# EAGLE design PaxInstrument-T400 (EAGLE 7.5.0)
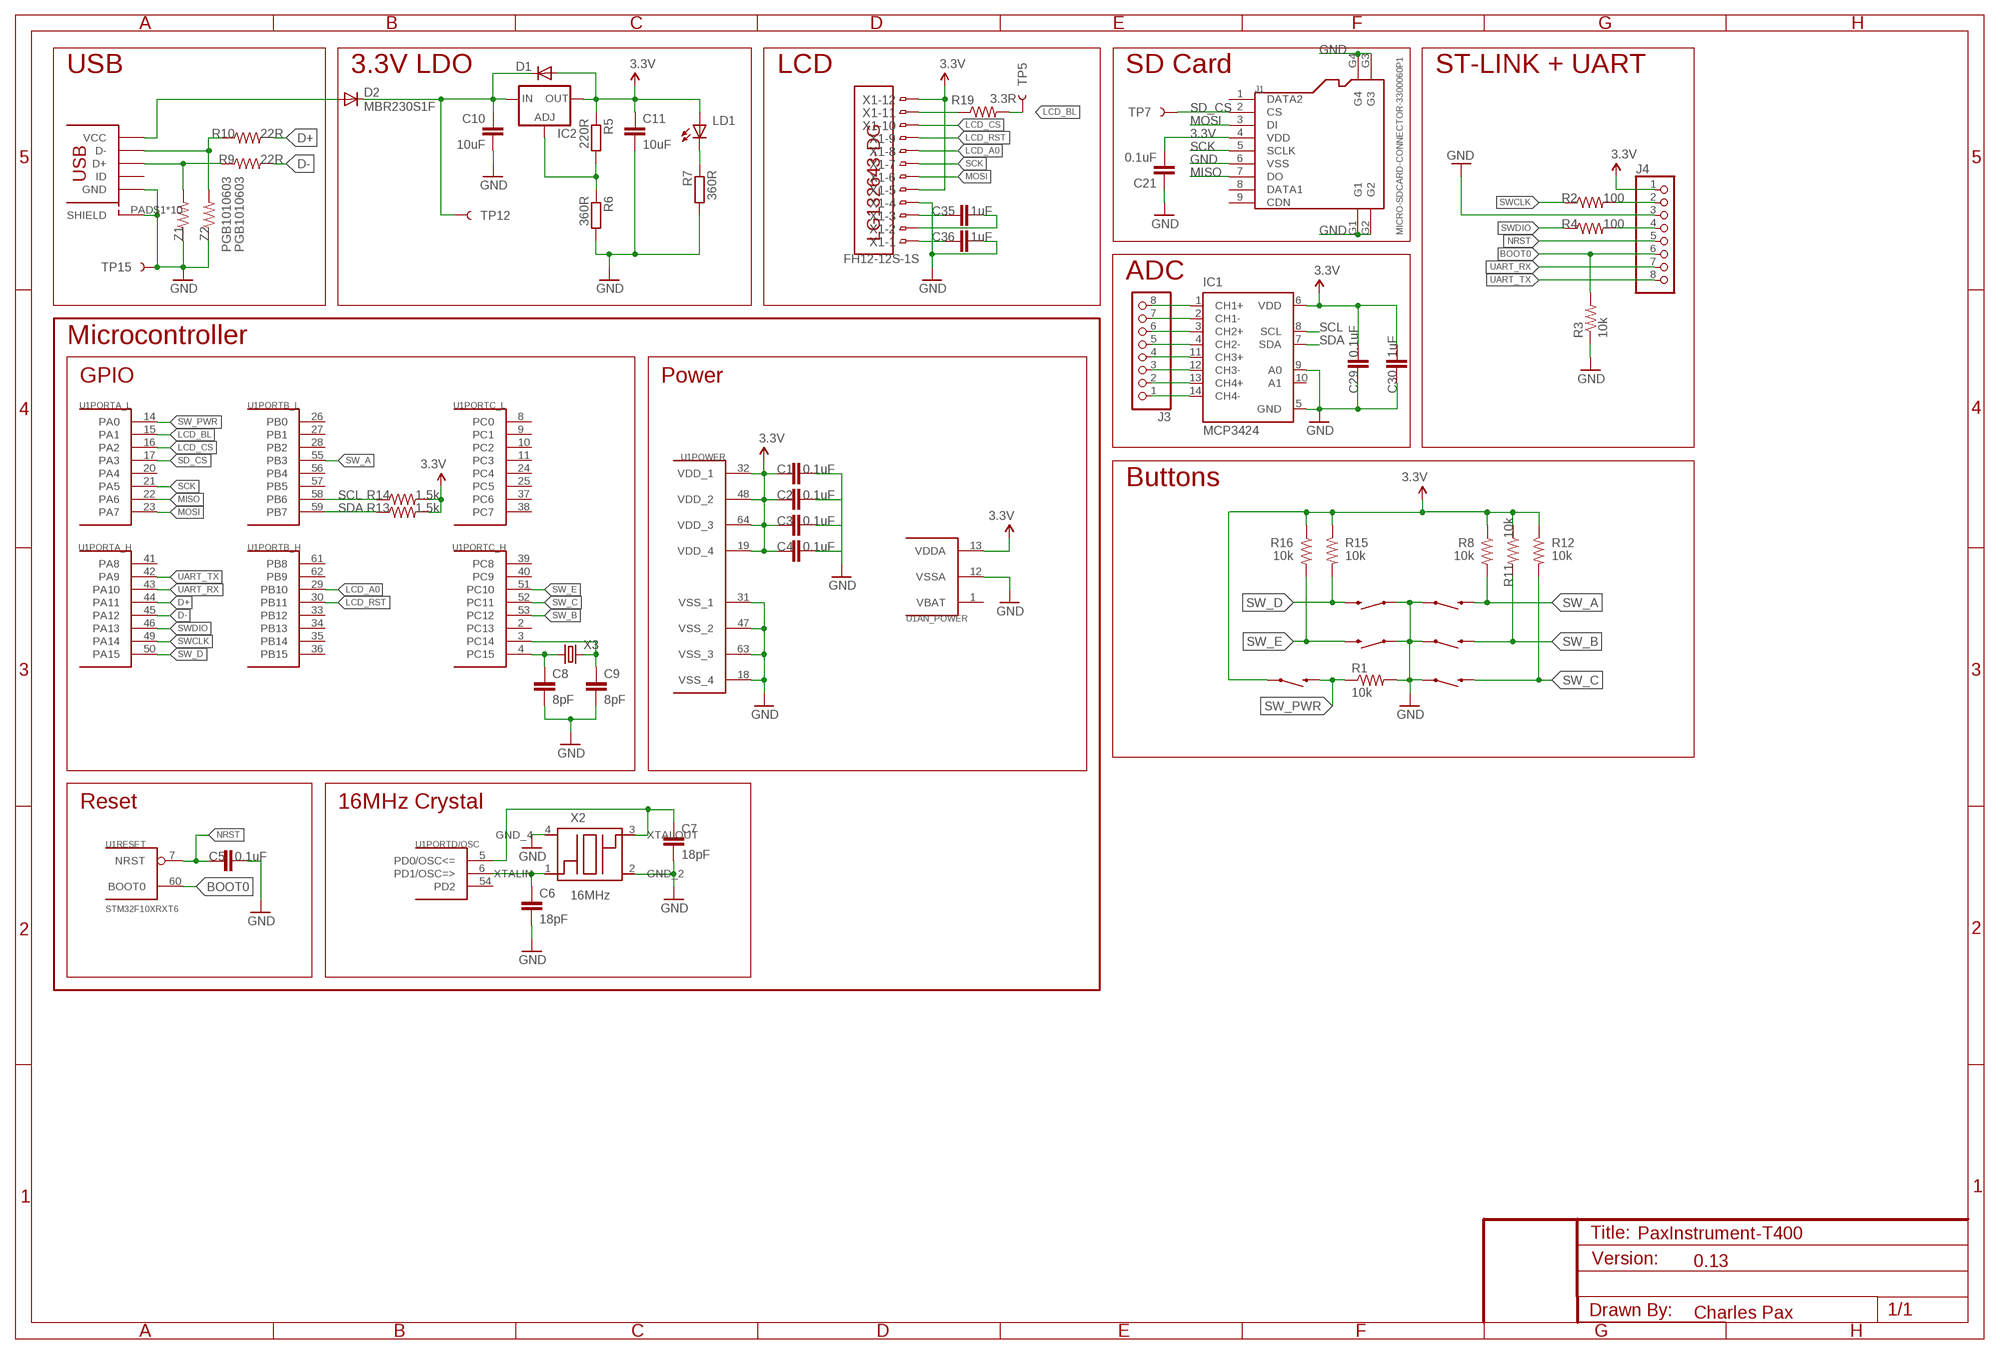
[diagram p0: schematic, sheet 1]

## Parts
C1  0.1uF  SPARKFUN-CAPACITORS_CAP0603-CAP  [SPARKFUN-CAPACITORS_0603-CAP]
C2  0.1uF  SPARKFUN-CAPACITORS_CAP0603-CAP  [SPARKFUN-CAPACITORS_0603-CAP]
C3  0.1uF  SPARKFUN-CAPACITORS_CAP0603-CAP  [SPARKFUN-CAPACITORS_0603-CAP]
C4  0.1uF  SPARKFUN-CAPACITORS_CAP0603-CAP  [SPARKFUN-CAPACITORS_0603-CAP]
C5  0.1uF  SPARKFUN-CAPACITORS_CAP0603-CAP  [SPARKFUN-CAPACITORS_0603-CAP]
C6  18pF  SPARKFUN-CAPACITORS_CAP0603-CAP  [SPARKFUN-CAPACITORS_0603-CAP]
C7  18pF  SPARKFUN-CAPACITORS_CAP0603-CAP  [SPARKFUN-CAPACITORS_0603-CAP]
C8  8pF  SPARKFUN-CAPACITORS_CAP0603-CAP  [SPARKFUN-CAPACITORS_0603-CAP]
C9  8pF  SPARKFUN-CAPACITORS_CAP0603-CAP  [SPARKFUN-CAPACITORS_0603-CAP]
C10  10uF  C0603  [0603]
C11  10uF  C0603  [0603]
C21  0.1uF  SPARKFUN-CAPACITORS_CAP0603-CAP  [SPARKFUN-CAPACITORS_0603-CAP]
C29  0.1uF  SPARKFUN-CAPACITORS_CAP0603-CAP  [SPARKFUN-CAPACITORS_0603-CAP]
C30  1uF  SPARKFUN-CAPACITORS_CAP0603-CAP  [SPARKFUN-CAPACITORS_0603-CAP]
C35  1uF  SPARKFUN-CAPACITORS_CAP0603-CAP  [SPARKFUN-CAPACITORS_0603-CAP]
C36  1uF  SPARKFUN-CAPACITORS_CAP0603-CAP  [SPARKFUN-CAPACITORS_0603-CAP]
D1  1N4148W  CGRM4001-G  [SOD-123_MINI-SMA]
D2  MBR230S1F  SPARKFUN-DISCRETESEMI_DIODESOD123SOD123  [SOD123]
IC1  MCP3424  [SO14]
IC2  LM317AEMP  LM317MSTT3  [SOT223]
J1  MICRO-SDCARD-CONNECTOR-3300060P1  [9P-SMD-W-RING]
J2  USB_MICROSMT+THRUHULE  [USB_MICRO_THRUHOLE]
J3  PINHD-1X8  [1X08]
J4  PINHD-1X8  [1X08]
LD1  LEDCHIPLED_0805  [CHIPLED_0805]
R1  10k  SPARKFUN-RESISTORS_RESISTOR0603-RES  [SPARKFUN-RESISTORS_0603-RES]
R2  100  SPARKFUN-RESISTORS_RESISTOR0603-RES  [SPARKFUN-RESISTORS_0603-RES]
R3  10k  SPARKFUN-RESISTORS_RESISTOR0603-RES  [SPARKFUN-RESISTORS_0603-RES]
R4  100  SPARKFUN-RESISTORS_RESISTOR0603-RES  [SPARKFUN-RESISTORS_0603-RES]
R5  220R  R0603  [0603]
R6  360R  R0603  [0603]
R7  360R  R0603  [0603]
R8  10k  SPARKFUN-RESISTORS_RESISTOR0603-RES  [SPARKFUN-RESISTORS_0603-RES]
R9  22R  SPARKFUN-RESISTORS_RESISTOR0603-RES  [SPARKFUN-RESISTORS_0603-RES]
R10  22R  SPARKFUN-RESISTORS_RESISTOR0603-RES  [SPARKFUN-RESISTORS_0603-RES]
R11  10k  SPARKFUN-RESISTORS_RESISTOR0603-RES  [SPARKFUN-RESISTORS_0603-RES]
R12  10k  SPARKFUN-RESISTORS_RESISTOR0603-RES  [SPARKFUN-RESISTORS_0603-RES]
R13  1.5k  SPARKFUN-RESISTORS_RESISTOR0603-RES  [SPARKFUN-RESISTORS_0603-RES]
R14  1.5k  SPARKFUN-RESISTORS_RESISTOR0603-RES  [SPARKFUN-RESISTORS_0603-RES]
R15  10k  SPARKFUN-RESISTORS_RESISTOR0603-RES  [SPARKFUN-RESISTORS_0603-RES]
R16  10k  SPARKFUN-RESISTORS_RESISTOR0603-RES  [SPARKFUN-RESISTORS_0603-RES]
R19  3.3R  SPARKFUN-RESISTORS_RESISTOR0603-RES  [SPARKFUN-RESISTORS_0603-RES]
S1  SWITCH-MOMENTARY-2SMD  [TACTILE_SWITCH_SMD]
S2  SWITCH-MOMENTARY-2SMD  [TACTILE_SWITCH_SMD]
S3  SWITCH-MOMENTARY-2SMD  [TACTILE_SWITCH_SMD]
S4  SWITCH-MOMENTARY-2SMD  [TACTILE_SWITCH_SMD]
S5  SWITCH-MOMENTARY-2SMD  [TACTILE_SWITCH_SMD]
S6  SWITCH-MOMENTARY-2SMD  [TACTILE_SWITCH_SMD]
TP5  LCD_BL  TEST-POINTTP_15TH_THRU  [TP_15TH]
TP7  SD_CS  TEST-POINTTP_15TH_THRU  [TP_15TH]
TP12  VBUS  TEST-POINTTP_15TH_THRU  [TP_15TH]
TP15  GND  TEST-POINTTP_15TH_THRU  [TP_15TH]
U1  STM32F10XRXT6  [TQFP64]
U$5  LG132643-DG  [LG132643-DG]
X1  FH12-12S-1S  [FH12-12S-1SH]
X2  16MHz  FA-238  [FA-238]
X3  CRYSTALTC26H  [TC26H]
Z1  PGB1010603  SPARKFUN-RESISTORS_RESISTOR0603-RES  [SPARKFUN-RESISTORS_0603-RES]
Z2  PGB1010603  SPARKFUN-RESISTORS_RESISTOR0603-RES  [SPARKFUN-RESISTORS_0603-RES]

## Nets
3.3V: C1.1 C2.1 C3.1 C4.1 C11.1 C21.2 C29.1 C30.1 D1.A IC1.6(VDD) IC2.2(OUT) IC2.4(OUT) J1.4(VDD) J4.1 LD1.A R5.1 R8.1 R11.1 R12.1 R13.2 R14.2 R15.1 R16.1 S6.1 U1.13(AN_POWER:VDDA) U1.19(POWER:VDD_4) U1.32(POWER:VDD_1) U1.48(POWER:VDD_2) U1.64(POWER:VDD_3) X1.5 X1.12
ADC_CH1_N: IC1.2(CH1-) J3.7
ADC_CH1_P: IC1.1(CH1+) J3.8
ADC_CH2_N: IC1.4(CH2-) J3.5
ADC_CH2_P: IC1.3(CH2+) J3.6
ADC_CH3_N: IC1.12(CH3-) J3.3
ADC_CH3_P: IC1.11(CH3+) J3.4
ADC_CH4_N: IC1.14(CH4-) J3.1
ADC_CH4_P: IC1.13(CH4+) J3.2
BOOT0: J4.6 R3.2 U1.60(RESET:BOOT0)
D+: R10.2 U1.44(PORTA_H:PA11)
D-: R9.2 U1.45(PORTA_H:PA12)
GND: C1.2 C5.2 C6.2 C7.2 C8.2 C9.2 C10.2 C11.2 C21.1 C29.2 C30.2 C36.1 IC1.5(GND) IC1.9(A0) J1.6(VSS) J1.G1 J1.G2 J1.G3 J1.G4 J2.PAD$1(SHIELD) J2.PAD$2(SHIELD) J2.PAD$3(SHIELD) J2.PAD$4(SHIELD) J2.PAD$5(SHIELD) J2.PAD$6(SHIELD) J2.PAD$7(SHIELD) J2.PAD$8(SHIELD) J2.PAD$9(SHIELD) J2.PAD$10(SHIELD) J2.PIN$5(GND) J4.3 R1.2 R3.1 R6.2 R7.2 S1.1 S2.1 S3.1 S4.1 S5.1 TP15.P$1 U1.12(AN_POWER:VSSA) U1.18(POWER:VSS_4) U1.31(POWER:VSS_1) U1.47(POWER:VSS_2) U1.63(POWER:VSS_3) X1.4 X2.2(GND_2) X2.4(GND_4) Z1.1 Z2.1
LCD_A0: U1.29(PORTB_H:PB10) X1.8
LCD_BL: R19.2 TP5.P$1 U1.15(PORTA_L:PA1)
LCD_CS: U1.16(PORTA_L:PA2) X1.10
LCD_RST: U1.30(PORTB_H:PB11) X1.9
MISO: J1.7(DO) U1.22(PORTA_L:PA6)
MOSI: J1.3(DI) U1.23(PORTA_L:PA7) X1.6
N$1: C7.1 U1.5(PORTD/OSC:PD0/OSC<=) X2.3(XTALOUT)
N$2: C2.2
N$4: R19.1 X1.11
N$5: C6.1 U1.6(PORTD/OSC:PD1/OSC=>) X2.1(XTALIN)
N$7: IC2.1(ADJ) R5.2 R6.1
N$10: LD1.C R7.1
N$13: C3.2
N$14: C4.2
N$16: C8.1 U1.4(PORTC_H:PC15) X3.1
N$17: C9.1 U1.3(PORTC_H:PC14) X3.2
N$25: J4.2 R2.2
N$27: J4.4 R4.2
N$31: J2.PIN$2(D-) R10.1 Z2.2
N$33: J2.PIN$3(D+) R9.1 Z1.2
N$37: C35.1 X1.3
N$38: C35.2 X1.2
N$39: C36.2 X1.1
NRST: C5.1 J4.5 U1.7(RESET:NRST)
SCK: J1.5(SCLK) U1.21(PORTA_L:PA5) X1.7
SCL: IC1.8(SCL) R14.1 U1.58(PORTB_L:PB6)
SD_CS: J1.2(CS) TP7.P$1 U1.17(PORTA_L:PA3)
SDA: IC1.7(SDA) R13.1 U1.59(PORTB_L:PB7)
SW_A: R8.2 S3.3 U1.55(PORTB_L:PB3)
SW_B: R11.2 S2.3 U1.53(PORTC_H:PC12)
SW_C: R12.2 S1.3 U1.52(PORTC_H:PC11)
SW_D: R15.2 S4.3 U1.50(PORTA_H:PA15)
SW_E: R16.2 S5.3 U1.51(PORTC_H:PC10)
SW_PWR: R1.1 S6.3 U1.14(PORTA_L:PA0)
SWCLK: R2.1 U1.49(PORTA_H:PA14)
SWDIO: R4.1 U1.46(PORTA_H:PA13)
UART_RX: J4.7 U1.43(PORTA_H:PA10)
UART_TX: J4.8 U1.42(PORTA_H:PA9)
VBUS [power]: C10.1 D1.C D2.C IC2.3(IN) TP12.P$1
VBUS_IN [power]: D2.A J2.PIN$1(VCC)
Unconnected: IC1.10(A1) J1.1(DATA2) J1.8(DATA1) J1.9(CDN) J2.PIN$4(ID) U1.2(PORTC_H:PC13) U1.8(PORTC_L:PC0) U1.9(PORTC_L:PC1) U1.10(PORTC_L:PC2) U1.11(PORTC_L:PC3) U1.20(PORTA_L:PA4) U1.24(PORTC_L:PC4) U1.25(PORTC_L:PC5) U1.26(PORTB_L:PB0) U1.27(PORTB_L:PB1) U1.28(PORTB_L:PB2) U1.33(PORTB_H:PB12) U1.34(PORTB_H:PB13) U1.35(PORTB_H:PB14) U1.36(PORTB_H:PB15) U1.37(PORTC_L:PC6) U1.38(PORTC_L:PC7) U1.39(PORTC_H:PC8) U1.40(PORTC_H:PC9) U1.41(PORTA_H:PA8) U1.54(PORTD/OSC:PD2) U1.56(PORTB_L:PB4) U1.57(PORTB_L:PB5) U1.61(PORTB_H:PB8) U1.62(PORTB_H:PB9)

## Notes on the sheet
- USB | 3.3V LDO | LCD | SD Card | ST-LINK + UART
- ADC
- Microcontroller
- GPIO | Power
- Buttons
- Reset | 16MHz Crystal
- 0.13
- Charles Pax

## Power pins joined to a net without a drawn wire
VBAT: U1.1(AN_POWER:VBAT)

## Library data of the parts
C1-C9 C21 C29 C30 C35 C36 = PaxInstrument-T400:SPARKFUN-CAPACITORS_CAP: Capacitor Standard 0603 ceramic capacitor, and 0.1" leaded capacitor.
C10 C11 = ell-i:C
D1 = diode:CGRM400*-G: Molded plasitc,JEDEC SOD-123/Mini SMA Source: Comchip CGRM4001-G.pdf
D2 = PaxInstrument-T400:SPARKFUN-DISCRETESEMI_DIODE: Diode These are standard reverse protection diodes and small signal diodes. SMA package can handle up to about 1A. SOD-323 can handle about 200mA. What the SOD-323 package when ordering, there are some mfgs out there that are 5-pin packages.; MF: DIODES INC; MPN: MBR230S1F-7
IC1 = JeeLabs:MCP3424: 18-Bit, 4-Channel Sampling ANALOG-TO-DIGITAL CONVERTER with I2C? Interface Source: www.ti.com .. ADS7828.pdf; MF: Microchip Technology; MPN: MCP3424-E/SL
IC2 = v-reg:LM317?*: 500 mA Adjustable Output Positive Voltage Regulator Source: http://www.onsemi.co.jp .. LM317M-D.PDF
J1 = PaxInstrument-T400:MICRO-SDCARD-CONNECTOR: Micro SD Card; MF: SUNTECH; MPN: ST-TF-003A
J2 = blinkinlabs:USB_MICRO; MF: FCI; MPN: 10118194-0001LF
J3 J4 = pinhead:PINHD-1X8: PIN HEADER
LD1 = adafruit:LED: LED OSRAM: - CHIPLED LG R971, LG N971, LY N971, LG Q971, LY Q971, LO R971, LY R971 LH N974, LH R974 LS Q976, LO Q976, LY Q976 LO Q996 - Hyper CHIPLED LW Q18S LB Q993, LB Q99A, LB R99A - SideLED LS A670, LO A670, LY A670, LG A670, LP A670 LB A673, LV A673, LT A673, LW A673 LH A674 LY A675 LS A676, LA A676, LO A676, LY A676, LW A676 LS A679, LY A679, LG A679 - Hyper Micro SIDELED® LS Y876, LA Y876, LO Y876, LY Y876 LT Y87S - SmartLED LW L88C, LW L88S LB L89C, LB L89S, LG L890 LS L89K, LO L89K, LY L89K LS L896, LA L896, LO L896, LY L896 - TOPLED LS T670, LO T670, LY T670, LG T670, LP T670 LSG T670, LSP T670, LSY T670, LOP T670, LYG T670 LG T671, LOG T671, LSG T671 LB T673, LV T673, LT T673, LW T673 LH T674 LS T676, LA T676, LO T676, LY T676, LB T676, LH T676, LSB T676, LW T676 LB T67C, LV T67C, LT T67C, LS T67K, LO T67K, LY T67K, LW E67C LS E67B, LA E67B, LO E67B, LY E67B, LB E67C, LV E67C, LT E67C LW T67C LS T679, LY T679, LG T679 LS T770, LO T770, LY T770, LG T770, LP T770 LB T773, LV T773, LT T773, LW T773 LH T774 LS E675, LA E675, LY E675, LS T675 LS T776, LA T776, LO T776, LY T776, LB T776 LHGB T686 LT T68C, LB T68C - Hyper Mini TOPLED® LB M676 - Mini TOPLED Santana® LG M470 LS M47K, LO M47K, LY M47K Source: http://www.osram.convergy.de/
R1-R4 R8 R11 R12 R15 R16 = PaxInstrument-T400:SPARKFUN-RESISTORS_RESISTOR: Resistor Basic schematic elements and footprints for 0603, 1206, and PTH resistors.; POPULATE: DNP
R5-R7 = ell-i:R
R9 R10 R13 R14 R19 = PaxInstrument-T400:SPARKFUN-RESISTORS_RESISTOR: Resistor Basic schematic elements and footprints for 0603, 1206, and PTH resistors.
S1-S6 = SparkFun-Electromechanical:SWITCH-MOMENTARY-2: Various NO switches- pushbuttons, reed, etc; MF: C&K Components; MPN: RS-187R05A2-DS MT RT
TP5 TP7 TP12 TP15 = PaxInstrument-T400:TEST-POINT: Bare copper test points for troubleshooting or ICT; MF: N/A; MPN: N/A
U1 = stm32:STM32F10XRXT6: STM32F101/103 64pin LQFP
U$5 = charlespax:LG132643-DG; MPN: LG132643-DW
X1 = PaxInstrument-T400:FH12-12S-1S; MF: Hirose Connector; MPN: FH12-12S-1SH(55)
X2 = crystals:FA-238
X3 = crystal:CRYSTAL: CRYSTAL; OC_FARNELL: unknown; OC_NEWARK: unknown
Z1 Z2 = PaxInstrument-T400:SPARKFUN-RESISTORS_RESISTOR: Resistor Basic schematic elements and footprints for 0603, 1206, and PTH resistors.; MF: Littelfuse; MPN: PGB1010603NRHF

## Net classes
0 default: width 0.203 mm, drill 0.33 mm
1 power: width 0.305 mm

## Board
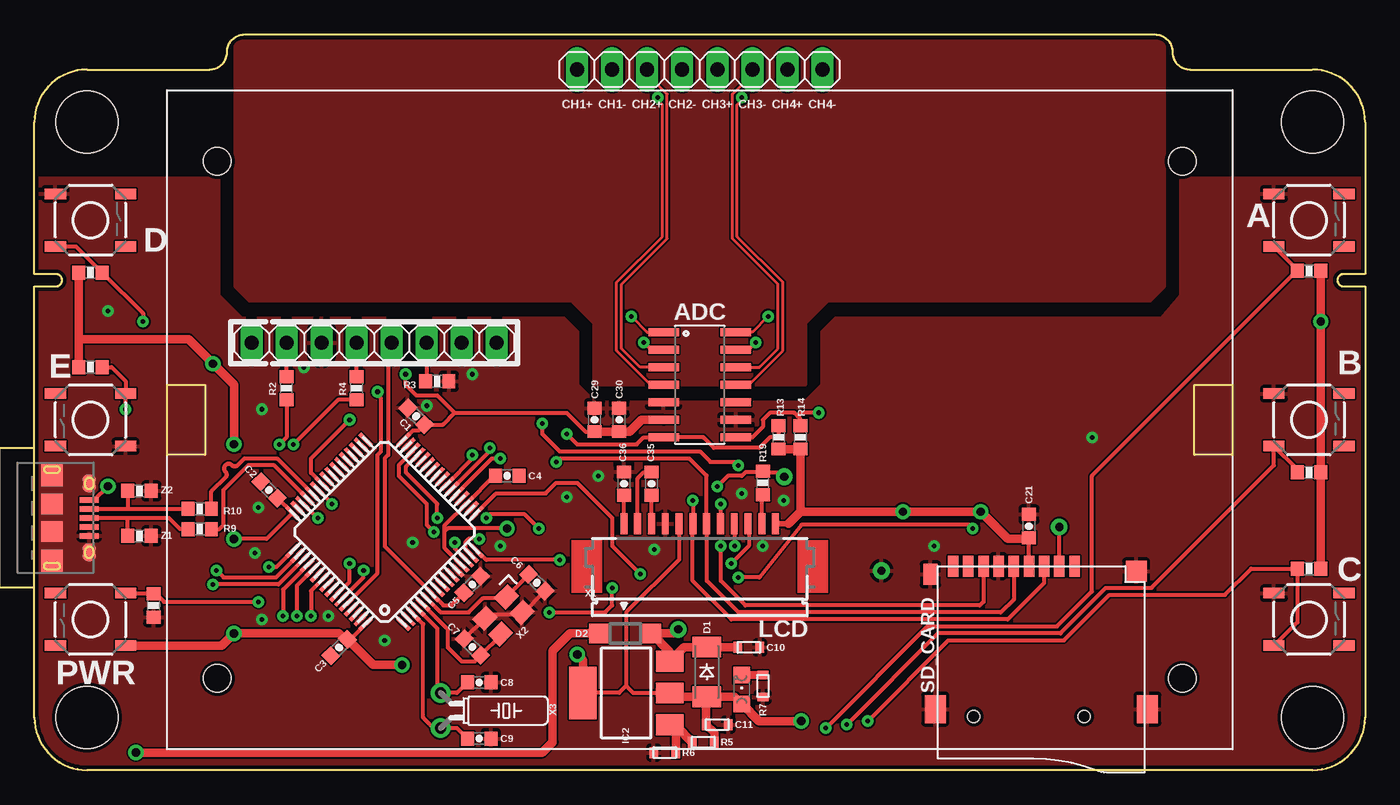
[diagram p1: board, top side]
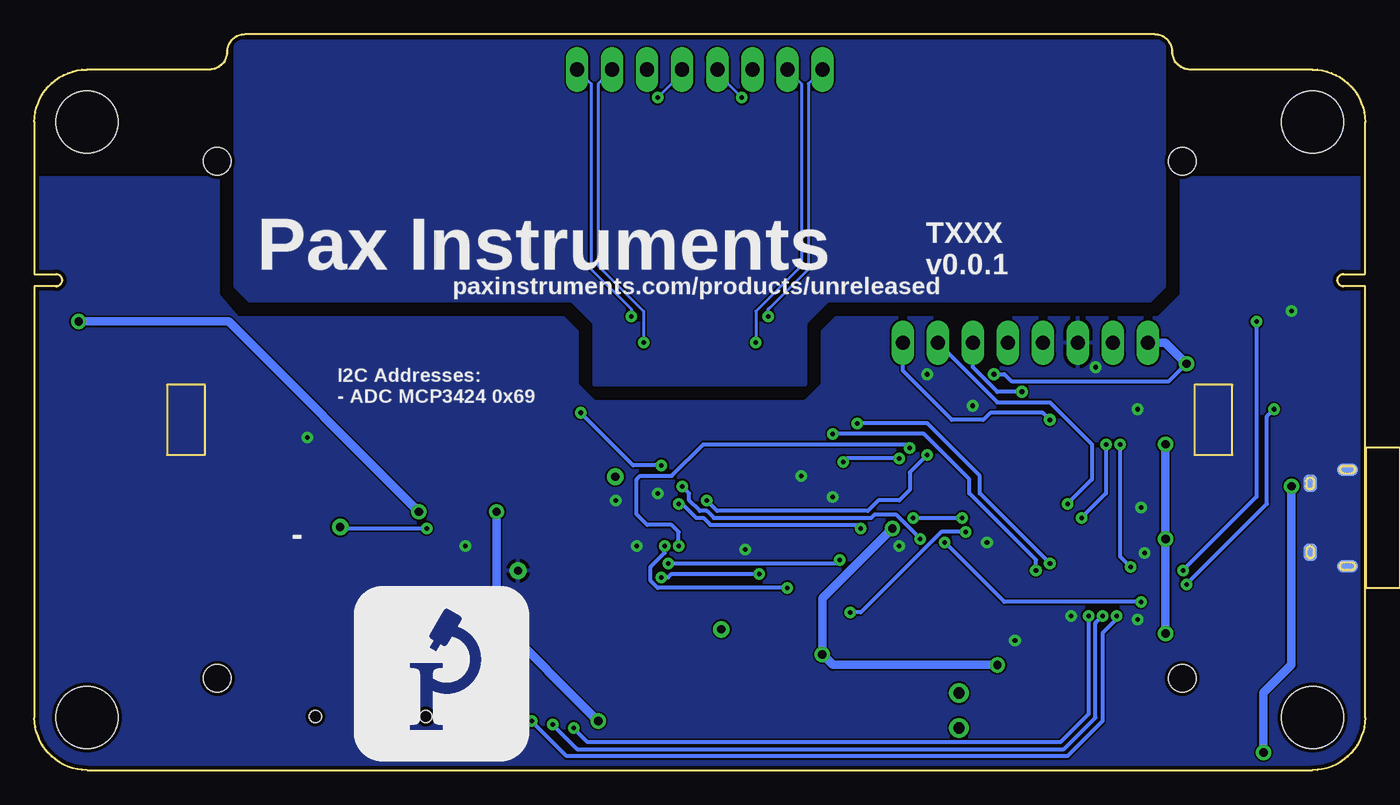
[diagram p2: board, bottom side, seen from below]

Size 96.52 x 53.34 mm. Coordinates in mm from the lower left corner, seen from the top.
Outline: 92.71,0 3.81,0 arc-90 0,3.81 0,35.07 1.55,35.07 arc90 2,35.52 arc90 1.55,35.97 0,35.97 0,46.99 arc-90 3.81,50.8 12.7,50.8 arc90 13.97,52.07 arc-90 15.24,53.34 81.28,53.34 arc-90 82.55,52.07 arc90 83.82,50.8 92.71,50.8 arc-90 96.52,46.99 96.52,35.97 94.97,35.97 arc90 94.52,35.52 arc90 94.97,35.07 96.52,35.07 96.52,3.81 arc-90 92.71,0
Copper layers (1*16): Top 0.035mm / dielectric 1.5mm / Bottom 0.035mm
Design rules "PaxInstrument-T400": minimum track width 6mil, minimum drill 13mil, track to track 5mil, track to pad 5mil, pad to pad 5mil, via to via 5mil, smd to smd 5mil, copper to edge 10mil, drill to drill 8mil, minimum pad ring 12mil, minimum via ring 10mil, stop-mask expansion 4mil, vias tented up to drill 25mil, thermal gap 10mil
Holes 4.5 mm at 92.71,3.81 92.71,46.99 3.81,46.99 3.81,3.81
tKeepout: area 0.3,0.3 to 7.3,7.3; area 0.3,43.5 to 7.3,50.5; area 89.2,43.5 to 96.2,50.5; area 89.2,0.3 to 96.2,7.3
Milling: 4 lines

### Footprints (pad centres in the part's own frame; a part is rotated, then mirrored left to right if it is on the bottom)
SPARKFUN-CAPACITORS_0603-CAP = smd 0.94 x 1.016: 1 -0.85,0; 2 0.85,0
0603 = smd 0.6 x 0.8: 1 -0.8,0; 2 0.8,0
SOD-123_MINI-SMA = smd 1.5 x 2.1: A 1.8,0; C -1.8,0
SOD123 = smd 1.4 x 1.4: A 1.9,0; C -1.9,0
SO14 = smd 0.61 x 2.21: 1 -3.81,-2.616; 2 -2.54,-2.616; 3 -1.27,-2.616; 4 0,-2.616; 5 1.27,-2.616; 6 2.54,-2.616; 7 3.81,-2.616; 8 3.81,2.616; 9 2.54,2.616; 10 1.27,2.616; 11 0,2.616; 12 -1.27,2.616; 13 -2.54,2.616; 14 -3.81,2.616
SOT223 = smd 1.5 x 2: 1 -2.3,-3.15; 2 0,-3.15; 3 2.3,-3.15 | smd 3.8 x 2: 4 0,3.15
9P-SMD-W-RING = smd 1.524 x 0.762: 1 -7.493,2.414; 2 -7.493,1.314; 3 -7.493,0.214; 4 -7.493,-0.886; 5 -7.493,-1.986; 6 -7.493,-3.086; 7 -7.493,-4.186; 8 -7.493,-5.286; 9 -7.493,-6.386 | smd 1.524 x 1.016: G1 -6.893,-8.032 | smd 2.032 x 1.524: G2 2.88,-7.686; G3 2.88,7.714 | smd 1.524 x 1.524: G4 -7.101,6.895 | hole 0.889: 3.407,-4.886; 3.407,3.114
USB_MICRO_THRUHOLE = smd 1.645 x 1.55: PAD$1 -3.123,0; PAD$4 3.123,0 | smd 1.5 x 1.55: PAD$2 -1,0; PAD$3 1,0 | smd 1.25 x 0.95: PAD$5 -2.5,2.7; PAD$6 2.5,2.7 | smd 0.9 x 1.55 bottom: PAD$7 -3.5,0; PAD$8 3.5,0 | smd 1.25 x 0.95 bottom: PAD$9 -2.5,2.7; PAD$10 2.5,2.7 | smd 0.4 x 1.35: PIN$1 -1.3,2.7; PIN$2 -0.65,2.7; PIN$3 0,2.7; PIN$4 0.65,2.7; PIN$5 1.3,2.7
1X08 = drill 1.016 long: 1 -8.89,0; 2 -6.35,0; 3 -3.81,0; 4 -1.27,0; 5 1.27,0; 6 3.81,0; 7 6.35,0; 8 8.89,0
CHIPLED_0805 = smd 1.2 x 1.2: A 0,-1.05; C 0,1.05
SPARKFUN-RESISTORS_0603-RES = smd 0.94 x 1.016: 1 -0.85,0; 2 0.85,0
TACTILE_SWITCH_SMD = smd 1.524 x 0.762: 1 -2.54,1.905; 2 2.54,1.905; 3 -2.54,-1.905; 4 2.54,-1.905
TP_15TH = drill 0.6 pad 1.168: P$1 0,0
TQFP64 = smd 1.2 x 0.3: 1 -5.7,3.75; 2 -5.7,3.25; 3 -5.7,2.75; 4 -5.7,2.25; 5 -5.7,1.75; 6 -5.7,1.25; 7 -5.7,0.75; 8 -5.7,0.25; 9 -5.7,-0.25; 10 -5.7,-0.75; 11 -5.7,-1.25; 12 -5.7,-1.75; 13 -5.7,-2.25; 14 -5.7,-2.75; 15 -5.7,-3.25; 16 -5.7,-3.75; 33 5.7,-3.75; 34 5.7,-3.25; 35 5.7,-2.75; 36 5.7,-2.25; 37 5.7,-1.75; 38 5.7,-1.25; 39 5.7,-0.75; 40 5.7,-0.25; 41 5.7,0.25; 42 5.7,0.75; 43 5.7,1.25; 44 5.7,1.75; 45 5.7,2.25; 46 5.7,2.75; 47 5.7,3.25; 48 5.7,3.75 | smd 0.3 x 1.2: 17 -3.75,-5.7; 18 -3.25,-5.7; 19 -2.75,-5.7; 20 -2.25,-5.7; 21 -1.75,-5.7; 22 -1.25,-5.7; 23 -0.75,-5.7; 24 -0.25,-5.7; 25 0.25,-5.7; 26 0.75,-5.7; 27 1.25,-5.7; 28 1.75,-5.7; 29 2.25,-5.7; 30 2.75,-5.7; 31 3.25,-5.7; 32 3.75,-5.7; 49 3.75,5.7; 50 3.25,5.7; 51 2.75,5.7; 52 2.25,5.7; 53 1.75,5.7; 54 1.25,5.7; 55 0.75,5.7; 56 0.25,5.7; 57 -0.25,5.7; 58 -0.75,5.7; 59 -1.25,5.7; 60 -1.75,5.7; 61 -2.25,5.7; 62 -2.75,5.7; 63 -3.25,5.7; 64 -3.75,5.7
LG132643-DG = hole 2: -35,-18.75; 35,-18.75; 35,18.75; -35,18.75
FH12-12S-1SH = smd 0.5 x 1.5: 1 -5.5,2.297; 2 -4.5,2.297; 3 -3.5,2.297; 4 -2.5,2.297; 5 -1.5,2.297; 6 -0.5,2.297; 7 0.5,2.297; 8 1.5,2.297; 9 2.5,2.297; 10 3.5,2.297; 11 4.5,2.297; 12 5.5,2.297
FA-238 = smd 1.4 x 1.2: 1 0,-1.6; 2 2.2,-1.6; 3 2.2,0; 4 0,0
TC26H = drill 0.813: 1 -1.27,0; 2 1.27,0

### Placement (x,y rotation side)
C1  27.69,25.65 135 top
C2  17.02,20.32 135 top
C3  22.1,8.89 225 top
C4  34.29,21.34 0 top
C5  31.75,13.46 45 top
C6  36.45,13.59 315 top
C7  31.78,8.92 135 top
C8  32.26,6.35 0 top
C9  32.26,2.29 0 top
C10  51.82,8.89 0 top
C11  49.53,3.3 0 top
C21  72.14,17.68 270 top
C29  40.64,25.4 90 top
C30  42.42,25.4 90 top
C35  44.76,20.76 90 top
C36  42.76,20.76 270 top
D1  48.77,7.11 270 top
D2  42.85,9.91 180 top
IC1  48.26,27.94 270 top
IC2  42.93,5.59 90 top
J1  73.03,7.3 270 top
J2  1.27,18.29 270 top
J3  48.26,50.8 180 top
J4  24.64,30.99 0 top
LD1  51.31,5.84 0 top
R1  8.64,11.94 270 top
R2  18.29,27.69 90 top
R3  29.21,28.19 180 top
R4  23.37,27.69 90 top
R5  48.51,2.03 180 top
R6  45.72,1.27 180 top
R7  52.83,6.1 270 top
R8  92.46,36.2 180 top
R9  11.99,17.48 0 top
R10  11.99,18.94 0 top
R11  92.46,21.59 180 top
R12  92.46,14.61 180 top
R13  53.98,24.13 270 top
R14  55.56,24.13 270 top
R15  4.06,36.07 0 top
R16  4.06,29.21 0 top
R19  52.83,20.83 90 top
S1  92.46,10.92 0 top
S2  92.46,25.4 0 top
S3  92.46,39.88 0 top
S4  4.06,39.88 0 top
S5  4.06,25.4 180 top
S6  4.06,10.92 180 top
TP5  54.39,21.27 0 top
TP7  74.34,17.62 0 top
TP12  46.69,10.2 270 top
TP15  61.44,14.45 0 top
U1  25.4,17.27 135 top
U$5  48.26,25.4 0 bottom
U$6  [PAX-LOGO-0.5IN]  73.34,0.64 0 bottom
X1  48.26,15.56 0 top
X2  35.37,11.43 225 top
X3  29.46,4.32 270 top
Z1  7.62,16.99 180 top
Z2  7.62,20.24 180 top

### Tracks (layer width: path | path; a pad name or v marks a point on that pad's centre or on a via)
3.3V  (via drill 0.33, 0.6)
  Top 0.305: J1.4 72.14,16.51 C21.2 | 28.03,25.21 C1.1 | C2.1 17.65,19.72 U1.48 16.83,16.76 v14.48,16.76 | C3.1 22.92,9.49 U1.64 | C4.1 33.35,21.34 U1.19 29.72,17.7 29.72,17.27 | U1.32 27.46,24.64 27.87,24.64 C1.1 | 29.72,17.27 29.72,16.14 U1.13 | 30.48,25.91 38.61,25.91 39.97,24.55 C29.1 | v34.29,17.53 29.97,17.53 29.72,17.27 | X1.5 46.76,15.26 42.93,11.43 42.93,6.1 | 42.93,6.1 43.43,5.59 IC2.2 | v26.92,28.7 26.92,27.94 27.69,27.18 29.21,27.18 30.48,25.91 | 28.19,25.15 C1.1 | 42.93,6.1 42.42,5.59 IC2.4 | C1.1 29.62,25.05 30.48,25.91
  Top 0.406: X1.12 54.69,17.86
  Top 0.61: C29.1 C30.1 43.18,24.55 44.03,25.4 IC1.6 | R12.1 R11.1 v93.31,32.53 R8.1 | R15.1 3.21,31.24 | 3.21,31.24 R16.1 | IC2.2 46.35,5.31 D1.A | D1.A 48.73,5.27 C11.1 49.31,2.72 R5.1 | D1.A 50.79,5.31 LD1.A 52.54,3.56 v55.63,3.56 | R13.2 R14.2 55.56,18.73 | 54.69,17.86 55.56,18.73 | 3.21,31.24 11.18,31.24 v12.95,29.46 14.48,27.94 v14.48,23.62 | S6.1 13.59,9.02 v14.48,9.91 22.1,9.91 22.51,9.49 C3.1 24.57,7.62 v26.67,7.62 | 55.56,18.73 v62.99,18.73 v68.64,18.73 70.61,16.76 72.06,16.76 C21.2 | IC2.4 39.78,7.98 v39.37,8.38
  Bottom 0.305: v26.92,28.7 26.16,28.7 25.65,28.19 14.22,28.19 v12.95,29.46
  Bottom 0.61: v12.95,29.46 14.48,30.99 J4.1 | v14.48,9.91 v14.48,16.76 v14.48,23.62 | v34.29,17.53 39.37,12.45 v39.37,8.38 38.61,7.62 v26.67,7.62 | v55.63,3.56 62.99,10.92 v62.99,18.73 | v93.31,32.53 82.44,32.53 v68.64,18.73
ADC_CH1_N  (via drill 0.33)
  Top 0.203: v44.2,30.99 44.7,30.48 IC1.2
  Bottom 0.203: J3.7 40.89,49.78 40.89,36.57 44.2,33.27 v44.2,30.99
ADC_CH1_P  (via drill 0.33)
  Top 0.203: v43.31,32.89 44.45,31.75 IC1.1
  Bottom 0.203: J3.8 40.39,49.78 40.39,36.33 43.18,33.53 43.31,33.4 v43.31,32.89
ADC_CH2_N  (via drill 0.33)
  Top 0.203: IC1.4 44.71,27.94 42.24,30.41 42.24,35.38 45.54,38.68 45.54,48.26 45.21,48.59 v45.21,48.77
  Bottom 0.203: v45.21,48.77 46.99,50.55 J3.5
ADC_CH2_P
  Top 0.203: IC1.3 43.94,29.21 42.6,30.55 42.6,35.23 45.9,38.53 45.9,49.02 44.45,50.47 J3.6
ADC_CH3_N
  Top 0.203: IC1.12 52.58,29.21 53.92,30.55 53.92,35.23 50.62,38.53 50.62,49.02 52.07,50.47 J3.3
ADC_CH3_P  (via drill 0.33)
  Top 0.203: IC1.11 51.81,27.94 54.28,30.41 54.28,35.38 50.98,38.68 50.98,48.26 51.31,48.59 v51.31,48.77
  Bottom 0.203: v51.31,48.77 49.53,50.55 J3.4
ADC_CH4_N  (via drill 0.33)
  Top 0.203: v53.21,32.89 52.07,31.75 IC1.14
  Bottom 0.203: J3.1 56.13,49.78 56.13,36.33 53.21,33.4 v53.21,32.89
ADC_CH4_P  (via drill 0.33)
  Top 0.203: v52.32,30.99 51.82,30.48 IC1.13
  Bottom 0.203: J3.2 55.63,49.78 55.63,36.57 52.32,33.27 v52.32,30.99
BOOT0  (via drill 0.33)
  Top 0.305: J4.6 28.45,28.28 R3.2 | U1.60 24.89,14.29 24.89,22.86 25.15,23.11 25.15,26.92 v24.89,27.43
  Bottom 0.305: v24.89,27.43 26.67,27.43 28.45,29.21 J4.6
D+
  Top 0.305: R10.2 12.84,20.2 13.84,21.21 arc90 13.84,21.65 13.84,21.65 arc-90 13.84,22.09 13.86,22.12 arc-90 14.3,22.12 14.31,22.11 arc90 14.75,22.11 15.24,22.61 17.59,22.61 U1.44
D-
  Top 0.305: R9.2 13.41,17.48 13.72,17.78 13.72,20.32 15.49,22.1 17.39,22.1 U1.45
GND  (via drill 0.33)
  Top 0.305: C6.2 35.43,11.37 X2.4 35.19,11.25 33.03,11.25 32.79,11.01 X2.2 C7.2
  other vias: 65.28,16.26 76.71,24.13 28.45,26.42 31.75,28.7 19.56,29.21 16.51,26.16 27.43,16.51 40.89,21.34 44.96,16 51.31,20.07 52.83,16.26 54.36,19.56 16.26,19.05 5.33,33.27 33.78,16.26 38.61,19.81 21.34,11.18 16.51,10.92 16,15.75 25.4,9.4
  pour Bottom: 96.52,42.93 96.52,0 0,0 0,42.93 13.34,42.93 13.34,34.42 14.99,32.77 38.37,32.77 39.37,31.77 39.37,27.94 40.64,26.67 55.88,26.67 57.15,27.94 57.15,31.77 58.15,32.77 81.79,32.77 83.19,34.42 83.19,42.93
  pour Top: 96.52,42.93 96.52,0 0,0 0,42.93 13.34,42.93 13.34,34.42 14.99,32.77 38.37,32.77 39.37,31.77 39.37,27.94 40.64,26.67 55.88,26.67 57.15,27.94 57.15,31.77 58.15,32.77 81.79,32.77 83.19,34.42 83.19,42.93
ISOTHERMAL
  pour Top: 81.92,52.83 81.92,35.04 80.92,34.04 57.53,34.04 55.88,32.38 55.88,27.94 40.64,27.94 40.64,32.38 38.99,34.04 15.61,34.04 14.61,35.04 14.61,52.83
  pour Bottom: 81.92,52.83 14.61,52.83 14.61,35.04 15.61,34.04 38.99,34.04 40.64,32.38 40.64,27.94 55.88,27.94 55.88,32.38 57.53,34.04 80.92,34.04 81.92,35.04
LCD_A0  (via drill 0.33)
  Top 0.305: v29.21,18.29 29.21,19.3 26.92,21.59 26.92,21.98 U1.29 | v32.77,18.29 33.02,18.54 35.56,18.54 v36.58,17.53 | v49.78,19.3 49.78,18.03 X1.8
  Bottom 0.305: v32.77,18.29 v29.21,18.29 | v36.58,17.53 36.83,17.78 47.5,17.78 48.01,18.29 48.51,18.29 49.53,19.3 v49.78,19.3
LCD_BL  (via drill 0.33)
  Top 0.305: 52.83,21.59 54.1,21.59 54.36,21.34 TP5.P$1 | v32.26,16.76 31.5,16.76 31.24,16.51 31.24,16 31.5,15.75 U1.15 | v49.53,20.57 50.29,21.34 51.31,21.34 51.56,21.59 52.83,21.59 | 52.83,21.59 R19.2
  Bottom 0.305: v32.26,16.76 34.04,18.54 35.56,18.54 35.81,18.29 47.24,18.29 47.75,18.8 48.26,18.8 49.02,19.56 49.02,20.07 v49.53,20.57
LCD_CS  (via drill 0.33)
  Top 0.305: v38.1,15.24 32.77,15.24 32.26,15.75 U1.16 | v50.55,14.99 51.82,16.26 51.82,17.78 X1.10
  Bottom 0.305: v50.55,14.99 38.35,14.99 v38.1,15.24
LCD_RST  (via drill 0.33)
  Top 0.305: v50.8,16.26 50.8,17.78 X1.9 | v28.96,17.27 28.45,17.78 28.45,19.3 26.42,21.34 26.42,22.1 27.43,23.11 U1.30 | v37.34,11.43 41.4,11.43 41.91,11.94 v41.91,13.21
  Bottom 0.305: v50.8,16.26 50.8,15.75 51.82,14.73 51.82,13.72 51.31,13.21 v41.91,13.21 | v28.96,17.27 30.73,17.27 36.58,11.43 v37.34,11.43
MISO  (via drill 0.33)
  Top 0.305: J1.7 68.84,12.2 68.58,11.94 51.56,11.94 49.78,13.72 v49.78,16.26 | v33.02,23.37 33.02,23.12 U1.22
  Bottom 0.305: v33.02,23.37 33.27,23.62 48.01,23.62 50.29,21.34 52.58,21.34 52.83,21.08 52.83,18.54 52.07,17.78 50.29,17.78 49.78,17.27 v49.78,16.26
MOSI  (via drill 0.33)
  Top 0.305: J1.3 73.24,13.55 70.61,10.92 50.55,10.92 47.75,13.72 47.75,17.85 X1.6 v47.76,19.56 | v31.75,22.86 31.75,22.56 U1.23
  Bottom 0.305: v31.75,22.86 33.02,21.59 33.02,20.32 33.78,19.56 35.31,19.56 36.07,18.8 47,18.8 v47.76,19.56
N$1
  Top 0.305: X2.3 33.87,9.81 C7.1 31.94,7.87 30.99,7.87 29.97,8.89 29.97,10.22 U1.5
N$4
  Top 0.305: X1.11 52.76,20.01 R19.1
N$5
  Top 0.305: C6.1 35.85,14.18 X2.1 34.04,12.45 32.51,12.45 31.5,11.43 29.46,11.43 28.7,12.19 U1.6
N$7
  Top 0.61: R5.2 46.57,3.17 46.19,3.17 IC2.1 46.52,2.84 R6.1
N$10
  Top 0.61: R7.1 LD1.C
N$16
  Top 0.305: C8.1 30.65,5.59 X3.1 29.21,5.84 29.21,10.28 U1.4
N$17
  Top 0.305: C9.1 30.65,3.05 X3.2 28.96,3.05 28.19,3.81 28.19,10.59 U1.3
N$25
  Top 0.305: R2.2 J4.2
N$27
  Top 0.305: R4.2 J4.4
N$31
  Top 0.305: J2.PIN$2 6.77,18.94 | 6.77,18.94 R10.1 | Z2.2 6.77,18.94
N$33
  Top 0.305: J2.PIN$3 6.77,18.29 | 6.77,18.29 9.75,18.29 10.21,17.83 10.4,17.64 10.56,17.48 R9.1 | Z1.2 6.77,18.29
N$37
  Top 0.305: X1.3 C35.1
N$38
  Top 0.305: X1.2 43.76,21.15 44.2,21.59 44.74,21.59 C35.2
N$39
  Top 0.305: X1.1 C36.2
NRST
  Top 0.305: C5.1 30.23,11.94 29.67,11.94 U1.7 25.4,16.21 25.4,22.61 25.65,22.86 25.65,29.46 25.91,29.72 J4.5
SCK  (via drill 0.33)
  Top 0.305: J1.5 71.04,12.37 70.1,11.43 51.05,11.43 48.77,13.72 48.77,17.85 X1.7 48.76,21.34 47.5,22.61 38.1,22.61 v37.85,22.35 | U1.21 33.21,22.61 v33.78,22.61
  Bottom 0.305: v33.78,22.61 37.59,22.61 v37.85,22.35
SCL  (via drill 0.33)
  Top 0.305: 55.56,24.77 R14.1 55.56,25.46 55.37,25.65 | 55.37,25.65 55.12,25.91 53.34,25.91 52.83,25.4 52.83,24.89 52.07,24.13 IC1.8 | U1.58 22.86,13.67 v22.86,14.99 | v36.83,25.15 36.83,24.38 38.1,23.11 48.26,23.11 49.02,22.35 50.8,22.35 v51.05,22.1 | v56.9,25.91 55.63,25.91 55.37,25.65
  Bottom 0.305: v22.86,14.99 27.94,20.07 27.94,21.34 31.75,25.15 v36.83,25.15 | v51.05,22.1 53.09,22.1 v56.9,25.91
SD_CS  (via drill 0.33)
  Top 0.305: J1.2 TP7.P$1 | v68.07,17.53 67.82,17.78 55.63,17.78 52.58,13.97 v51.05,13.97 | v43.94,14.22 41.91,16.26 41.91,18.29 39.37,20.83 37.85,20.83 37.08,20.07 33.5,20.07 U1.17
  Bottom 0.305: v51.05,13.97 50.55,13.97 50.29,14.22 v43.94,14.22 | v68.07,17.53 74.17,17.53 TP7.P$1
SDA  (via drill 0.33)
  Top 0.305: R13.1 53.98,24.26 53.85,24.13 53.34,24.13 52.58,23.37 49.28,23.37 48.51,24.13 IC1.7 44.2,24.13 43.69,23.62 39.37,23.62 v38.61,24.38 | U1.59 23.88,13.98 v23.88,14.48
  Bottom 0.305: v23.88,14.48 23.88,15.24 28.7,20.07 28.7,21.08 32,24.38 v38.61,24.38
SW_A  (via drill 0.33)
  Top 0.305: S3.3 91.61,36.28 R8.2 91.57,36.2 76.71,21.34 76.71,12.95 74.17,10.41 64.77,10.41 v57.4,3.05 | U1.55 20.07,13 v20.07,11.18
  Bottom 0.305: v20.07,11.18 20.07,4.06 22.1,2.03 56.39,2.03 v57.4,3.05
SW_B  (via drill 0.33)
  Top 0.305: R11.2 91.61,21.8 S2.3 89.92,22.1 81.03,13.21 77.72,13.21 74.42,9.91 65.53,9.91 v58.93,3.3 | v19.05,11.18 19.05,13.4 U1.53
  Bottom 0.305: v58.93,3.3 57.15,1.52 21.84,1.52 19.56,3.81 19.56,10.67 v19.05,11.18
SW_C  (via drill 0.33)
  Top 0.305: S1.3 91.61,10.71 R12.2 88.27,14.61 86.36,12.7 77.98,12.7 74.68,9.4 66.29,9.4 v60.45,3.56 | U1.52 18.03,13.09 v18.03,11.18
  Bottom 0.305: v18.03,11.18 18.03,10.92 19.05,9.91 19.05,3.56 21.59,1.02 57.91,1.02 v60.45,3.56
SW_D  (via drill 0.33)
  Top 0.305: S4.3 3.01,37.97 R15.2 7.87,33.11 v7.87,32.51 | v13.21,14.48 13.72,13.97 17.53,13.97 19.07,15.52 U1.50
  Bottom 0.305: v7.87,32.51 7.87,19.81 v13.21,14.48
SW_E  (via drill 0.33)
  Top 0.305: R16.2 5.59,29.21 6.6,28.19 S5.3 v6.6,26.16 | U1.51 17.7,13.46 v12.95,13.46
  Bottom 0.305: v12.95,13.46 7.11,19.3 7.11,25.65 v6.6,26.16
SW_PWR  (via drill 0.33)
  Top 0.305: S6.3 6.64,12.79 R1.1 8.64,12.7 8.89,12.7 9.4,12.19 v16.26,12.19 | v30.48,16.51 30.48,16.08 U1.14
  Bottom 0.305: v30.48,16.51 26.16,12.19 v16.26,12.19
SWCLK  (via drill 0.33)
  Top 0.305: R2.1 18.29,24.13 v17.78,23.62 | v17.02,14.73 17.56,14.73 U1.49
  Bottom 0.305: v17.78,23.62 17.78,15.49 v17.02,14.73
SWDIO  (via drill 0.33)
  Top 0.305: R4.1 22.01,26.84 v18.8,23.62 | v20.57,18.29 20.5,18.29 U1.46
  Bottom 0.305: v18.8,23.62 18.8,20.07 v20.57,18.29
UART_RX  (via drill 0.33)
  Top 0.305: v21.59,19.3 21.59,19.31 U1.43
  Bottom 0.305: J4.7 26.67,26.67 22.86,26.67 19.81,23.62 19.81,21.08 v21.59,19.3
UART_TX  (via drill 0.33)
  Top 0.305: U1.42 20.07,21.55 20.07,22.61 v22.86,25.4
  Bottom 0.305: v22.86,25.4 23.37,25.91 27.18,25.91 27.69,25.4 29.97,25.4 33.53,28.96 J4.8
VBUS
  Top 0.61: C10.1 48.79,8.89 D1.C 47.1,8.91 IC2.3 46.08,8.58 D2.C 46.4,9.91 TP12.P$1
VBUS_IN  (via drill 0.6)
  Top 0.305: J2.PIN$1 4.35,19.59 v5.33,20.57
  Top 0.61: v7.37,1.27 36.83,1.27 37.59,2.03 37.59,8.64 38.86,9.91 D2.A
  Bottom 0.61: v7.37,1.27 7.37,5.59 5.33,7.62 v5.33,20.57

### Text on the board
tPlace: A | D | ADC | B | E | C | LCD | PWR | SD_CARD
bPlace: Pax Instruments | TXXX / v0.0.1 | paxinstruments.com/products/unreleased | I2C Addresses: / - ADC MCP3424 0x69 | -
tNames: CH1+ | CH1- | CH2+ | CH2- | CH3+ | CH3- | CH4+ | CH4-